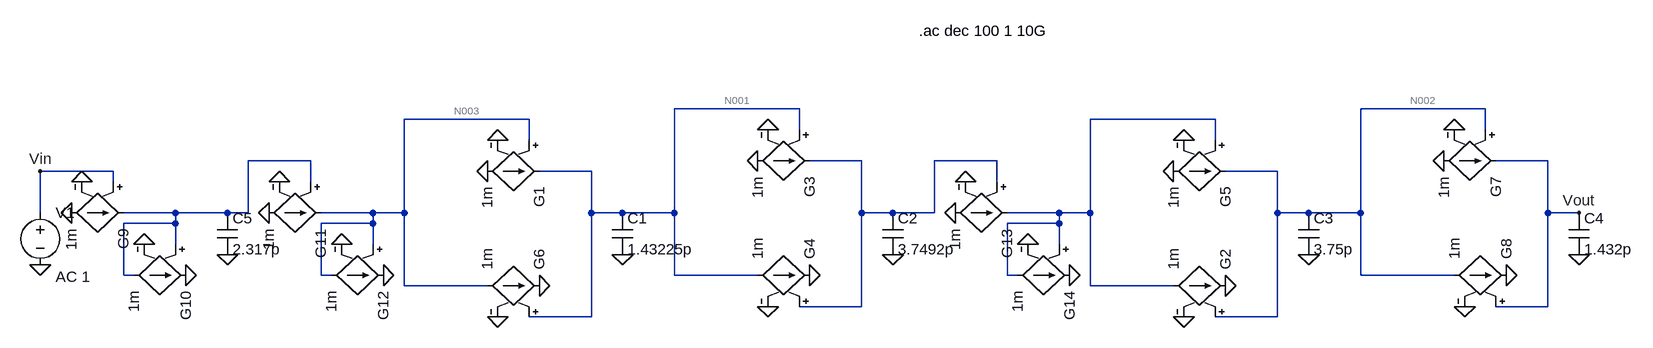
[diagram p0: schematic GmCMaxFlatIdeal.asc]
GmCMaxFlatIdeal.asc, the LTspice schematic file:
Version 4
SHEET 1 1976 680
WIRE 704 -112 512 -112
WIRE 1760 -112 1568 -112
WIRE 288 -96 96 -96
WIRE 1344 -96 1152 -96
WIRE 704 -80 704 -112
WIRE 1760 -80 1760 -112
WIRE 288 -64 288 -96
WIRE 1344 -64 1344 -96
WIRE -48 -32 -144 -32
WIRE 800 -32 720 -32
WIRE 1008 -32 912 -32
WIRE 1856 -32 1776 -32
WIRE -352 -16 -464 -16
WIRE 384 -16 304 -16
WIRE 1440 -16 1360 -16
WIRE -352 0 -352 -16
WIRE -48 0 -48 -32
WIRE 1008 0 1008 -32
WIRE -464 48 -464 -16
WIRE -256 48 -336 48
WIRE -176 48 -256 48
WIRE -144 48 -144 -32
WIRE -144 48 -176 48
WIRE 48 48 -32 48
WIRE 96 48 96 -96
WIRE 96 48 48 48
WIRE 384 48 384 -16
WIRE 432 48 384 48
WIRE 512 48 512 -112
WIRE 512 48 432 48
WIRE 800 48 800 -32
WIRE 848 48 800 48
WIRE 912 48 912 -32
WIRE 912 48 848 48
WIRE 1104 48 1024 48
WIRE 1152 48 1152 -96
WIRE 1152 48 1104 48
WIRE 1440 48 1440 -16
WIRE 1488 48 1440 48
WIRE 1568 48 1568 -112
WIRE 1568 48 1488 48
WIRE 1856 48 1856 -32
WIRE 1904 48 1856 48
WIRE -256 64 -256 48
WIRE -256 64 -336 64
WIRE 48 64 48 48
WIRE 48 64 -32 64
WIRE 1104 64 1104 48
WIRE 1104 64 1024 64
WIRE -256 96 -256 64
WIRE 48 96 48 64
WIRE 1104 96 1104 64
WIRE -336 144 -336 64
WIRE -320 144 -336 144
WIRE -32 144 -32 64
WIRE -16 144 -32 144
WIRE 512 144 512 48
WIRE 640 144 512 144
WIRE 1024 144 1024 64
WIRE 1040 144 1024 144
WIRE 1568 144 1568 48
WIRE 1712 144 1568 144
WIRE 96 160 96 48
WIRE 224 160 96 160
WIRE 1152 160 1152 48
WIRE 1280 160 1152 160
WIRE 800 192 800 48
WIRE 800 192 704 192
WIRE 1856 192 1856 48
WIRE 1856 192 1776 192
WIRE 384 208 384 48
WIRE 384 208 288 208
WIRE 1440 208 1440 48
WIRE 1440 208 1344 208
FLAG -176 112 0
FLAG -464 128 0
FLAG 224 -16 0
FLAG 240 -64 0
FLAG 640 -32 0
FLAG 656 -80 0
FLAG 432 112 0
FLAG 848 112 0
FLAG 1280 -16 0
FLAG 1296 -64 0
FLAG 1696 -32 0
FLAG 1712 -80 0
FLAG 1728 192 0
FLAG 1792 144 0
FLAG 1488 112 0
FLAG 1904 112 0
FLAG 1296 208 0
FLAG 1360 160 0
FLAG 656 192 0
FLAG 720 144 0
FLAG 240 208 0
FLAG 304 160 0
FLAG -416 48 0
FLAG -400 0 0
FLAG -304 96 0
FLAG -240 144 0
FLAG -112 48 0
FLAG -96 0 0
FLAG 0 96 0
FLAG 64 144 0
FLAG 944 48 0
FLAG 960 0 0
FLAG 1056 96 0
FLAG 1120 144 0
FLAG -464 -16 Vin
FLAG 1904 48 Vout
SYMBOL cap -192 48 R0
SYMATTR InstName C5
SYMATTR Value 2.317p
SYMBOL voltage -464 32 R0
WINDOW 123 24 114 Left 2
WINDOW 39 0 0 Left 0
SYMATTR Value2 AC 1
SYMATTR InstName V1
SYMATTR Value ""
SYMBOL g 320 -16 R90
SYMATTR InstName G1
SYMATTR Value 1m
SYMBOL cap 416 48 R0
SYMATTR InstName C1
SYMATTR Value 1.43225p
SYMBOL g 736 -32 R90
SYMATTR InstName G3
SYMATTR Value 1m
SYMBOL cap 832 48 R0
SYMATTR InstName C2
SYMATTR Value 3.7492p
SYMBOL g 1376 -16 R90
SYMATTR InstName G5
SYMATTR Value 1m
SYMBOL cap 1472 48 R0
SYMATTR InstName C3
SYMATTR Value 3.75p
SYMBOL g 1792 -32 R90
SYMATTR InstName G7
SYMATTR Value 1m
SYMBOL g 1808 144 M270
SYMATTR InstName G8
SYMATTR Value 1m
SYMBOL cap 1888 48 R0
SYMATTR InstName C4
SYMATTR Value 1.432p
SYMBOL g 1376 160 M270
SYMATTR InstName G2
SYMATTR Value 1m
SYMBOL g 736 144 M270
SYMATTR InstName G4
SYMATTR Value 1m
SYMBOL g 320 160 M270
SYMATTR InstName G6
SYMATTR Value 1m
SYMBOL g -320 48 R90
SYMATTR InstName G9
SYMATTR Value 1m
SYMBOL g -224 144 R90
SYMATTR InstName G10
SYMATTR Value 1m
SYMBOL g -16 48 R90
SYMATTR InstName G11
SYMATTR Value 1m
SYMBOL g 80 144 R90
SYMATTR InstName G12
SYMATTR Value 1m
SYMBOL g 1040 48 R90
SYMATTR InstName G13
SYMATTR Value 1m
SYMBOL g 1136 144 R90
SYMATTR InstName G14
SYMATTR Value 1m
TEXT 888 -232 Left 2 !.ac dec 100 1 10G

The netlist it stands for:
* GmCMaxFlatIdeal.asc
C5 N005 0 2.317p
V1 Vin 0 AC 1
G1 0 N001 N003 0 1m
C1 N001 0 1.43225p
G3 0 N006 N001 0 1m
C2 N006 0 3.7492p
G5 0 N002 N004 0 1m
C3 N002 0 3.75p
G7 0 Vout N002 0 1m
G8 N002 0 Vout 0 1m
C4 Vout 0 1.432p
G2 N004 0 N002 0 1m
G4 N001 0 N006 0 1m
G6 N003 0 N001 0 1m
G9 0 N005 Vin 0 1m
G10 N005 0 N005 0 1m
G11 0 N003 N005 0 1m
G12 N003 0 N003 0 1m
G13 0 N004 N006 0 1m
G14 N004 0 N004 0 1m
.ac dec 100 1 10G
.backanno
.end

* Results of the author's LTspice run, read from the files saved beside the schematic
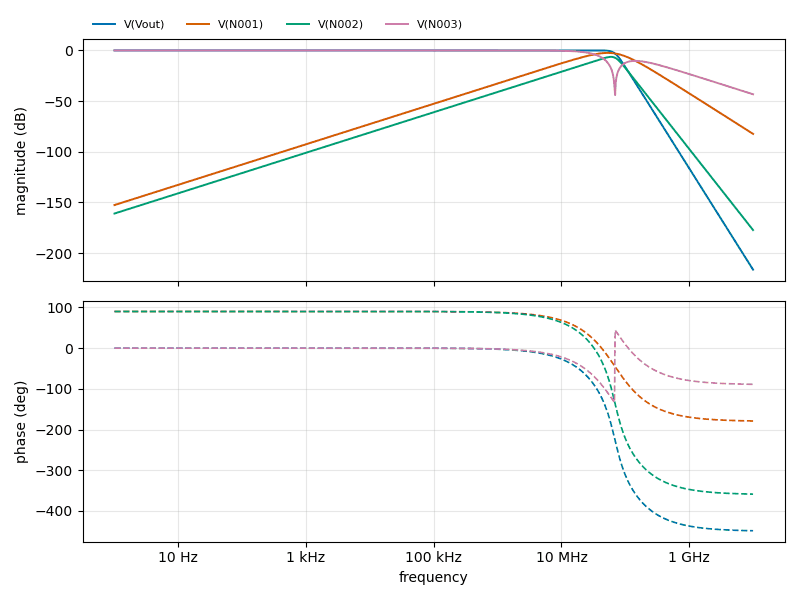
[diagram p1: AC Analysis of GmCMaxFlatIdeal.asc, plotted from the saved traces]
* AC Analysis, 1 run:
*   V(Vout): -0.00 dB at 1 Hz, -216.32 dB at 10 GHz, peak 0.00 dB at 22.39 MHz, 3 dB below the peak at 68.67 MHz
*   V(N001): -152.56 dB at 1 Hz, -82.35 dB at 10 GHz, peak -2.46 dB at 52.48 MHz, 3 dB below the peak at 25.29 MHz and 96.57 MHz
*   V(N002): -160.92 dB at 1 Hz, -177.23 dB at 10 GHz, peak -6.35 dB at 60.26 MHz, 3 dB below the peak at 37.86 MHz and 77.02 MHz
*   V(N003): -0.00 dB at 1 Hz, -43.26 dB at 10 GHz, peak -0.00 dB at 1.175 Hz, 3 dB below the peak at 29.07 MHz